# EAGLE design Adafruit TXB0108 (EAGLE 5.01)
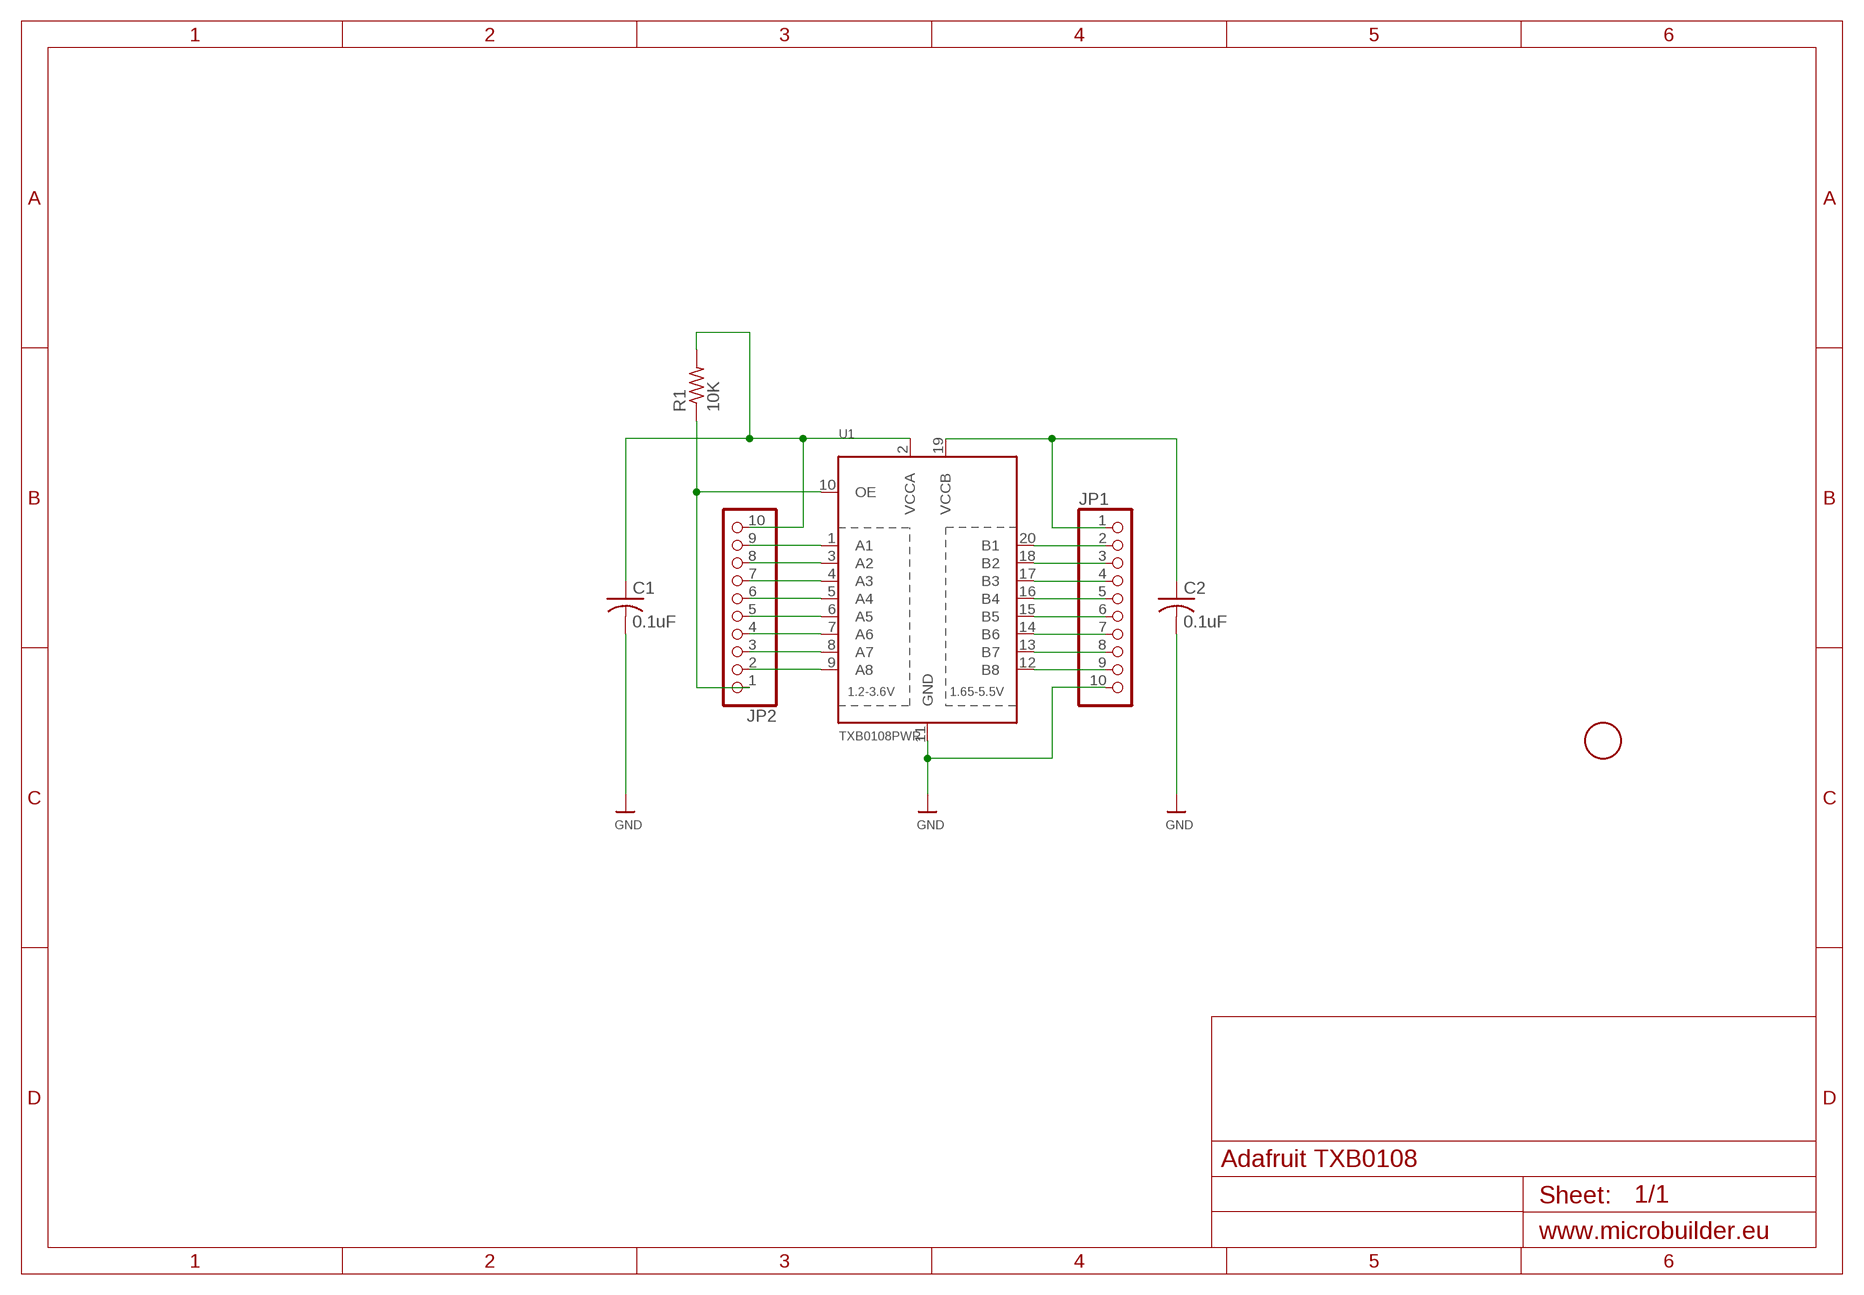
[diagram p0: schematic, sheet 1]

## Parts
C1  0.1uF  C-USC0805  [C0805]
C2  0.1uF  C-USC0805  [C0805]
JP1  HEADER-1X10THICKER  [1X10_ROUND_76]
JP2  HEADER-1X10THICKER  [1X10_ROUND_76]
R1  10K  R-US_R0805  [R0805]
U1  TXB0108PWR  [TSSOP20]
U$6  FIDUCIAL  [FIDUCIAL_1MM]

## Nets
GND: C1.2 C2.2 JP1.10 U1.11(GND)
N$2: JP1.9 U1.12(B8)
N$3: JP1.8 U1.13(B7)
N$4: JP1.7 U1.14(B6)
N$5: JP1.6 U1.15(B5)
N$6: JP1.5 U1.16(B4)
N$7: JP1.4 U1.17(B3)
N$8: JP1.3 U1.18(B2)
N$9: JP1.2 U1.20(B1)
N$10: C2.1 JP1.1 U1.19(VCCB)
N$11: C1.1 JP2.10 R1.2 U1.2(VCCA)
N$12: JP2.9 U1.1(A1)
N$13: JP2.8 U1.3(A2)
N$14: JP2.7 U1.4(A3)
N$15: JP2.6 U1.5(A4)
N$16: JP2.5 U1.6(A5)
N$17: JP2.4 U1.7(A6)
N$18: JP2.3 U1.8(A7)
N$19: JP2.2 U1.9(A8)
N$20: JP2.1 R1.1 U1.10(OE)

## Library data of the parts
C1 C2 = adafruit:C-US: CAPACITOR, American symbol
JP1 JP2 = microbuilder:HEADER-1X10: PIN HEADER
R1 = adafruit:R-US_: RESISTOR, American symbol
U1 = microbuilder:TXB0108PWR: 8-Bit Bi-Directional Level Shifter 1.2V-3.6V (VCCA) to 1.65V-5.5V (VCCB) bi-directional level shifter with auto direction sensing. Max data rate - VCCA 1.8V: 20Mbps (50ns), VCCA 3.3V: 100Mbps (10ns) Digikey: 296-21527-1-ND
U$6 = adafruit:FIDUCIAL: For use by pick and place machines to calibrate the vision/machine, 1mm By microbuilder.eu

## Board
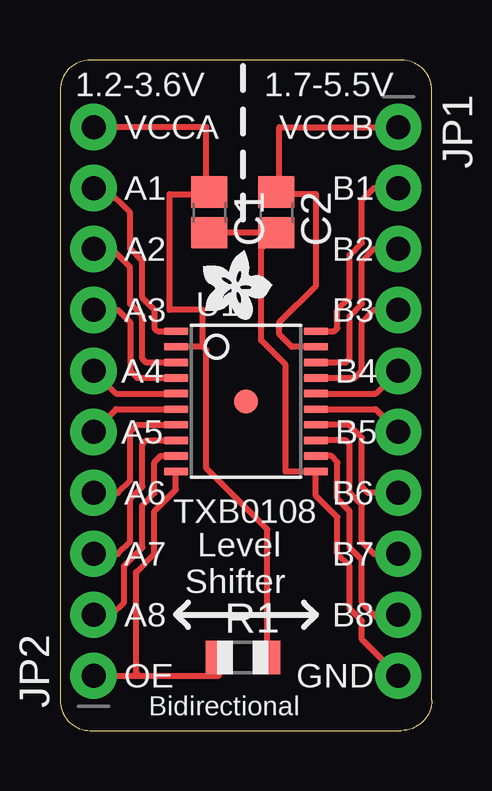
[diagram p1: board, top side]

Size 15.49 x 27.94 mm. Coordinates in mm from the lower left corner, seen from the top.
Outline: 15.49,1.27 15.49,26.67 arc90 14.22,27.94 1.27,27.94 arc90 0,26.67 0,1.27 arc90 1.27,0 14.22,0 arc90 15.49,1.27
Copper layers (1*16): Top 0.035mm / dielectric 1.5mm / Bottom 0.035mm
Design rules "default": minimum track width 8mil, minimum drill 0.4mm, track to track 8mil, track to pad 8mil, pad to pad 8mil, via to via 8mil, smd to smd 8mil, copper to edge 20mil, drill to drill 8mil, minimum pad ring 8mil, minimum via ring 10mil, stop-mask expansion 3mil, vias tented up to drill 0mil, thermal gap 8mil

### Footprints (pad centres in the part's own frame; a part is rotated, then mirrored left to right if it is on the bottom)
C0805 = smd 1.3 x 1.5: 1 -0.85,0; 2 0.85,0
1X10_ROUND_76 = drill 1 pad 1.93 round: 1 -11.43,0; 2 -8.89,0; 3 -6.35,0; 4 -3.81,0; 5 -1.27,0; 6 1.27,0; 7 3.81,0; 8 6.35,0; 9 8.89,0; 10 11.43,0
R0805 = smd 1.1 x 1.4: 1 -1,0; 2 1,0
TSSOP20 = smd 0.305 x 0.991: 1 -2.925,-2.918; 2 -2.275,-2.918; 3 -1.625,-2.918; 4 -0.975,-2.918; 5 -0.325,-2.918; 6 0.325,-2.918; 7 0.975,-2.918; 8 1.625,-2.918; 9 2.275,-2.918; 10 2.925,-2.918; 11 2.925,2.918; 12 2.275,2.918; 13 1.625,2.918; 14 0.975,2.918; 15 0.325,2.918; 16 -0.325,2.918; 17 -0.975,2.918; 18 -1.625,2.918; 19 -2.275,2.918; 20 -2.925,2.918
FIDUCIAL_1MM = smd 1 x 1: 1 0,0

### Placement (x,y rotation side)
C1  6.22,21.59 270 top
C2  9.02,21.59 270 top
JP1  14.1,13.72 270 top
JP2  1.4,13.72 90 top
R1  7.62,3.05 0 top
U1  7.75,13.72 270 top
U$4  [ADAFRUIT200MIL]  7.37,18.67 270 top
U$6  7.75,13.72 0 top

### Tracks (layer width: path | path; a pad name or v marks a point on that pad's centre or on a via)
GND
  Top 0.254: JP1.10 12.57,3.81 12.57,4.57 12.07,5.08 12.07,6.86 11.56,7.37 11.56,8.89 10.66,9.78 U1.11 9.4,10.79 9.4,15.24 8.38,16.26 8.38,20.07 9.02,20.7 C2.2 8.89,20.74 | 8.89,20.74 C1.2 | 8.89,20.74 8.89,20.83
N$2
  Top 0.254: U1.12 11.29,11.44 11.56,11.18 11.56,9.65 12.07,9.14 12.07,7.62 12.57,7.11 12.57,5.33 13.34,4.57 13.84,4.57 JP1.9
N$3
  Top 0.254: U1.13 11.91,12.09 12.07,11.94 12.07,9.91 12.57,9.4 12.57,7.87 13.08,7.37 JP1.8
N$4
  Top 0.254: U1.14 12.02,12.74 12.57,12.19 12.57,10.16 12.83,9.91 JP1.7
N$5
  Top 0.254: U1.15 13.15,13.39 JP1.6
N$6
  Top 0.254: U1.16 13.15,14.04 JP1.5
N$7
  Top 0.254: U1.17 12.28,14.69 12.57,14.99 12.57,17.02 13.08,17.53 JP1.4
N$8
  Top 0.254: U1.18 11.91,15.34 12.07,15.49 12.07,17.27 12.57,17.78 12.57,19.56 13.08,20.07 JP1.3
N$9
  Top 0.254: U1.20 11.43,16.64 11.56,16.76 11.56,17.53 12.07,18.03 12.07,19.81 12.57,20.32 12.57,22.1 13.08,22.61 JP1.2
N$10
  Top 0.254: U1.19 9.66,15.99 9.14,16.51 9.14,17.02 10.67,18.54 10.67,22.35 9.14,22.35 | 9.14,22.35 9.14,22.44 | 9.14,22.44 C2.1 9.11,22.35 9.14,22.35 | JP1.1 9.14,25.15 9.14,22.44
N$11
  Top 0.254: 5.96,15.99 U1.2 | 5.96,15.99 6.1,15.85 6.1,10.92 8.64,8.38 8.64,3.06 R1.2 | JP2.10 6.1,25.15 6.1,22.44 | 5.96,15.99 5.96,17.53 4.57,17.53 4.57,22.35 6.1,22.35 6.1,22.44 | 6.1,22.44 C1.1
N$12
  Top 0.254: U1.1 4.06,16.64 3.94,16.76 3.94,17.53 3.43,18.03 3.43,19.56 2.92,20.07 2.92,21.59 1.9,22.61 JP2.9
N$13
  Top 0.254: U1.3 3.58,15.34 3.43,15.49 3.43,17.27 2.92,17.78 2.92,19.3 2.16,20.07 JP2.8
N$14
  Top 0.254: U1.4 3.22,14.69 2.92,14.99 2.92,17.02 2.41,17.53 JP2.7
N$15
  Top 0.254: U1.5 2.34,14.04 JP2.6
N$16
  Top 0.254: U1.6 2.34,13.39 JP2.5
N$17
  Top 0.254: U1.7 3.22,12.74 2.92,12.45 2.92,10.41 2.41,9.91 JP2.4
N$18
  Top 0.254: U1.8 3.58,12.09 3.43,11.94 3.43,10.16 2.92,9.65 2.92,7.87 2.41,7.37 JP2.3
N$19
  Top 0.254: U1.9 4.2,11.44 3.94,11.18 3.94,9.91 3.43,9.4 3.43,7.62 2.67,6.86 2.67,5.33 2.16,4.83 JP2.2
N$20
  Top 0.254: U1.10 4.83,10.04 3.94,9.14 3.94,7.37 3.17,6.6 3.17,2.41 3.3,2.29 | JP2.1 3.3,2.29 | 3.3,2.29 6.62,2.29 R1.1

### Text on the board
tPlace: 1.2-3.6V | 1.7-5.5V | VCCB | VCCA | B1 | A1 | B2 | A2 | B3 | A3 | B4 | A4 | B5 | A5 | B6 | A6 | TXB0108 | Level | B7 | A7 | Shifter | B8 | A8 | GND | OE | Bidirectional